# EAGLE schematic small (EAGLE 9.1.0)
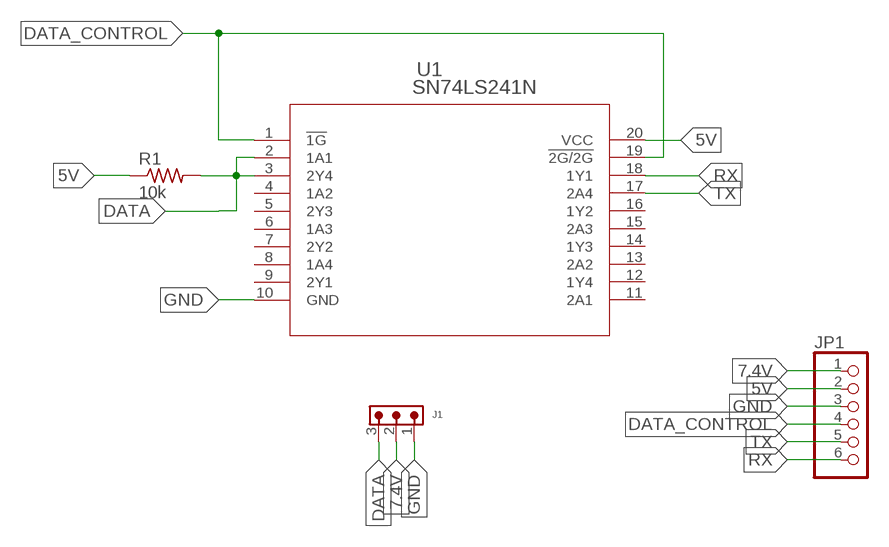
[diagram p0: schematic, sheet 1]

## Parts
J1  62000311622  [62000311622]
JP1  PINHD-1X6  [1X06]
R1  10k  R-US_M0805  [M0805]
U1  SN74LS241N  [N20]

## Nets
5V: JP1.2 R1.1 U1.20(VCC)
7.4V: J1.2 JP1.1
DATA: J1.3 R1.2 U1.2(1A1) U1.3(2Y4)
DATA_CONTROL: JP1.4 U1.1(!1G) U1.19(!2G/2G)
GND: J1.1 JP1.3 U1.10(GND)
RX: JP1.6 U1.18(1Y1)
TX: JP1.5 U1.17(2A4)
Unconnected: U1.4(1A2) U1.5(2Y3) U1.6(1A3) U1.7(2Y2) U1.8(1A4) U1.9(2Y1) U1.11(2A1) U1.12(1Y4) U1.13(2A2) U1.14(1Y3) U1.15(2A3) U1.16(1Y2)

## Library data of the parts
J1 = Wurth_Connectors_WR-WTB:62000311622: WR-WTB 2.00 mm Male Vertical Shrouded Header KIND PROPERTIES: Pitch:2mm Gender:Male MATERIAL PROPERTIES: Insulator Material :PA46 Insulator Flammability Rating:UL94 V-0 Insulator Color:Beige;​ White Contact Material:Copper Alloy Contact Plating:Tin Contact Type:Stamped GENERAL INFORMATION Operating Temperature:-25 up to +85 °C Compliance: RoHS Working Voltage:125 V (AC) Withstanding Voltage:800 V (AC) Contact Resistance:20 mΩ RISO:1000 MΩ CERTIFICATION UL Approval:E323964 PACKAGING PROPERTIES Packaging:Bag <https://katalog.we-online.com/media/images/v2/o33351v209%20Family_WR-WTB_6200xx11622.jpg> Details see: https://katalog.we-online.com/en/em/WTB_2_00_MALE_VERTICAL_SHROUDED_HEADER_6200XX11622 Updated by Yingchun,Shan 2019-11-06 2019 (C) Würth Elektronik; CONTACT-RESISTANCE: 20mOhm; DATASHEET-URL: https://www.we-online.com/catalog/datasheet/62000311622.pdf; GENDER: Male; IR: 2A; L: 8mm; MOUNT: THT; PACKAGING: Bag; PART-NUMBER: 62000311622; PCB-CABLE-PANEL: PCB; PINS: 3; PITCH: 2mm; TOL-R: max.; TYPE: Vertical; USE-WITH: WR-WTB 2.00 mm Female Terminal Housing; WORKING-VOLTAGE: 125V(AC)
JP1 = adafruit:PINHD-1X6: PIN HEADER
R1 = adafruit:R-US_: RESISTOR, American symbol
U1 = 74LS241:SN74LS241N; BUILT_BY: EMA_UL_Team; MANUFACTURER_PART_NUMBER: SN74LS241N; VENDOR: Texas Instruments